# Altium schematic sheet Power.SchDoc
size A
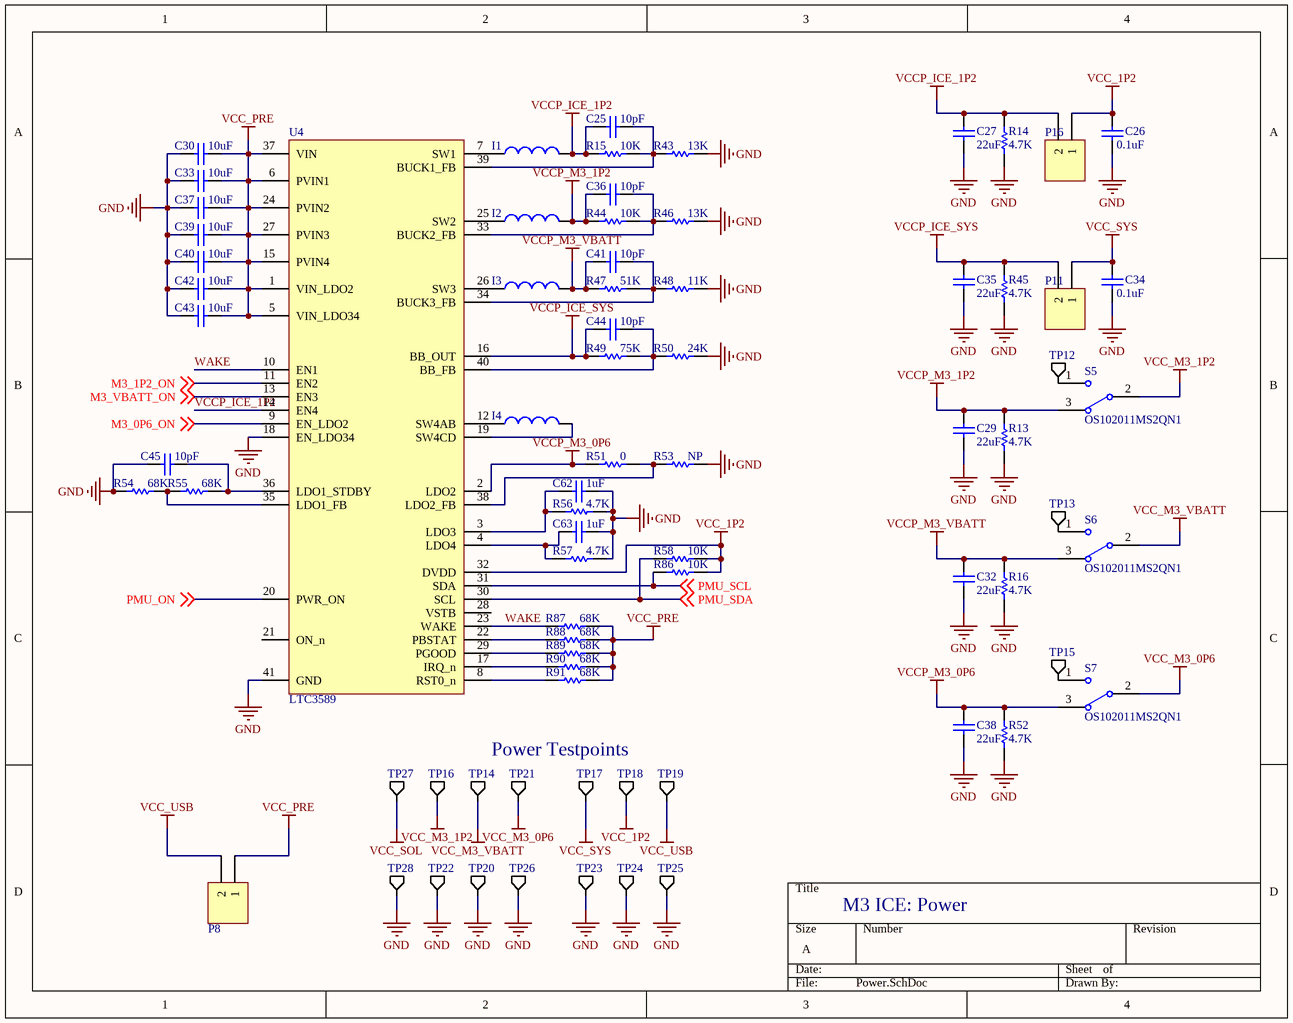
[diagram p0: Power.SchDoc]

## Parts
C25  value 10pF  [0402]  (hidden comment: Cap Semi)
C26  value 0.1uF  [1608[0603]]  (hidden comment: Cap Semi)
C27  value 22uF  [0805]  (hidden comment: Cap Chip)
C29  value 22uF  [0805]  (hidden comment: Cap Chip)
C30  value 10uF  [0805]  (hidden comment: Cap Chip)
C32  value 22uF  [0805]  (hidden comment: Cap Chip)
C33  value 10uF  [0805]  (hidden comment: Cap Chip)
C34  value 0.1uF  [1608[0603]]  (hidden comment: Cap Semi)
C35  value 22uF  [0805]  (hidden comment: Cap Chip)
C36  value 10pF  [0402]  (hidden comment: Cap Semi)
C37  value 10uF  [0805]  (hidden comment: Cap Chip)
C38  value 22uF  [0805]  (hidden comment: Cap Chip)
C39  value 10uF  [0805]  (hidden comment: Cap Chip)
C40  value 10uF  [0805]  (hidden comment: Cap Chip)
C41  value 10pF  [0402]  (hidden comment: Cap Semi)
C42  value 10uF  [0805]  (hidden comment: Cap Chip)
C43  value 10uF  [0805]  (hidden comment: Cap Chip)
C44  value 10pF  [0402]  (hidden comment: Cap Semi)
C45  value 10pF  [0402]  (hidden comment: Cap Semi)
C62  value 1uF  [0402]  (hidden comment: Cap Semi)
C63  value 1uF  [0402]  (hidden comment: Cap Semi)
I1  NR5040T1R5N  [INDUCTOR_.118x.142mm]  (value not drawn)
I2  NR5040T1R5N  [INDUCTOR_.118x.142mm]  (value not drawn)
I3  NR5040T1R5N  [INDUCTOR_.118x.142mm]  (value not drawn)
I4  NR5040T1R5N  [INDUCTOR_.118x.142mm]  (value not drawn)
P8  Header 2  [HDR1X2]  (value not drawn)
P11  Header 2  [HDR1X2]  (value not drawn)
P16  Header 2  [HDR1X2]  (value not drawn)
R13  value 4.7K  [0603]  (hidden comment: Res Chip)
R14  value 4.7K  [0603]  (hidden comment: Res Chip)
R15  value 10K  [0402]  (hidden comment: Res Chip)
R16  value 4.7K  [0603]  (hidden comment: Res Chip)
R43  value 13K  [0402]  (hidden comment: Res Chip)
R44  value 10K  [0402]  (hidden comment: Res Chip)
R45  value 4.7K  [0603]  (hidden comment: Res Chip)
R46  value 13K  [0402]  (hidden comment: Res Chip)
R47  value 51K  [0402]  (hidden comment: Res Chip)
R48  value 11K  [0402]  (hidden comment: Res Chip)
R49  value 75K  [0402]  (hidden comment: Res Chip)
R50  value 24K  [0402]  (hidden comment: Res Chip)
R51  value 0  [0402]  (hidden comment: Res Chip)
R52  value 4.7K  [0603]  (hidden comment: Res Chip)
R53  value NP  [0402]  (hidden comment: Res Chip)
R54  value 68K  [0402]  (hidden comment: Res Chip)
R55  value 68K  [0402]  (hidden comment: Res Chip)
R56  value 4.7K  [0402]  (hidden comment: Res Chip)
R57  value 4.7K  [0402]  (hidden comment: Res Chip)
R58  value 10K  [0402]  (hidden comment: Res Chip)
R86  value 10K  [0402]  (hidden comment: Res Chip)
R87  value 68K  [0402]  (hidden comment: Res Chip)
R88  value 68K  [0402]  (hidden comment: Res Chip)
R89  value 68K  [0402]  (hidden comment: Res Chip)
R90  value 68K  [0402]  (hidden comment: Res Chip)
R91  value 68K  [0402]  (hidden comment: Res Chip)
S5  OS102011MS2QN1  [SPDT_SW2]
S6  OS102011MS2QN1  [SPDT_SW2]
S7  OS102011MS2QN1  [SPDT_SW2]
TP12  TP  [TP]  (value not drawn)
TP13  TP  [TP]  (value not drawn)
TP14  TP  [TP]  (value not drawn)
TP15  TP  [TP]  (value not drawn)
TP16  TP  [TP]  (value not drawn)
TP17  TP  [TP]  (value not drawn)
TP18  TP  [TP]  (value not drawn)
TP19  TP  [TP]  (value not drawn)
TP20  TP  [TP]  (value not drawn)
TP21  TP  [TP]  (value not drawn)
TP22  TP  [TP]  (value not drawn)
TP23  TP  [TP]  (value not drawn)
TP24  TP  [TP]  (value not drawn)
TP25  TP  [TP]  (value not drawn)
TP26  TP  [TP]  (value not drawn)
TP27  TP  [TP]  (value not drawn)
TP28  TP  [TP]  (value not drawn)
U4  LTC3589  [QFN-40]

## Nets
GND: C26.1 C27.1 C29.1 C30.2 C32.1 C33.2 C34.1 C35.1 C37.2 C38.1 C39.2 C40.2 C42.2 C43.2 C45.2 C62.1 C63.1 R13.1 R14.1 R16.1 R43.2 R45.1 R46.2 R48.2 R50.2 R52.1 R53.2 R54.1 R56.2 R57.2 TP20.1(A) TP22.1(A) TP23.1(A) TP24.1(A) TP25.1(A) TP26.1(A) TP28.1(A) U4.18(EN_LDO34) U4.41(GND)
VCC_1P2: C26.2 P16.1 R58.2 R86.2 TP18.1(A) U4.32(DVDD)
VCC_M3_0P6: S7.2 TP21.1(A)
VCC_M3_1P2: S5.2 TP16.1(A)
VCC_M3_VBATT: S6.2 TP14.1(A)
VCC_PRE: C30.1 C33.1 C37.1 C39.1 C40.1 C42.1 C43.1 P8.1 R87.2 R88.2 R89.2 R90.2 R91.2 U4.1(VIN_LDO2) U4.5(VIN_LDO34) U4.6(PVIN1) U4.15(PVIN4) U4.24(PVIN2) U4.27(PVIN3) U4.37(VIN)
VCC_SOL: TP27.1(A)
VCC_SYS: C34.2 P11.1 TP17.1(A)
VCC_USB: P8.2 TP19.1(A)
VCCP_ICE_1P2: C25.2 C27.2 I1.2 P16.2 R14.2 R15.1 U4.14(EN4)
VCCP_ICE_SYS: C35.2 C44.2 P11.2 R45.2 R49.1 U4.16(BB_OUT)
VCCP_M3_0P6: C38.2 R51.1 R52.2 S7.3 U4.2(LDO2)
VCCP_M3_1P2: C29.2 C36.2 I2.2 R13.2 R44.1 S5.3
VCCP_M3_VBATT: C32.2 C41.2 I3.2 R16.2 R47.1 S6.3
M3_0P6_ON: U4.9(EN_LDO2) ; off-sheet M3_0P6_ON
M3_1P2_ON: U4.11(EN2) ; off-sheet M3_1P2_ON
M3_VBATT_ON: U4.13(EN3) ; off-sheet M3_VBATT_ON
PMU_ON: U4.20(PWR_ON) ; off-sheet PMU_ON
PMU_SCL: R86.1 U4.31(SDA) ; off-sheet PMU_SCL
PMU_SDA: R58.1 U4.30(SCL) ; off-sheet PMU_SDA
WAKE: R87.1 U4.10(EN1) U4.23(WAKE)
NetC25_1: C25.1 R15.2 R43.1 U4.39(BUCK1_FB)
NetC36_1: C36.1 R44.2 R46.1 U4.33(BUCK2_FB)
NetC41_1: C41.1 R47.2 R48.1 U4.34(BUCK3_FB)
NetC44_1: C44.1 R49.2 R50.1 U4.40(BB_FB)
NetC45_1: C45.1 R55.2 U4.36(LDO1_STDBY)
NetC62_2: C62.2 R56.1 U4.3(LDO3)
NetC63_2: C63.2 R57.1 U4.4(LDO4)
NetI1_1: I1.1 U4.7(SW1)
NetI2_1: I2.1 U4.25(SW2)
NetI3_1: I3.1 U4.26(SW3)
NetI4_1: I4.1 U4.12(SW4AB)
NetI4_2: I4.2 U4.19(SW4CD)
NetR51_2: R51.2 R53.1 U4.38(LDO2_FB)
NetR54_2: R54.2 R55.1 U4.35(LDO1_FB)
NetR88_1: R88.1 U4.22(PBSTAT)
NetR89_1: R89.1 U4.29(PGOOD)
NetR90_1: R90.1 U4.17(IRQ_n)
NetR91_1: R91.1 U4.8(RST0_n)
NetS5_1: S5.1 TP12.1(A)
NetS6_1: S6.1 TP13.1(A)
NetS7_1: S7.1 TP15.1(A)

Not connected (* = marked no-connect by the designer): U4 21(ON_n) 28(VSTB)

## Notes on the sheet
- Power Testpoints
- M3 ICE: Power

## Library data of the parts
C25 C36 C41 C44 C45 = Cap Semi: Capacitor (Semiconductor SIM Model); DistPartNo: 445-1235-1-ND; ManPartNo: C1005C0G1H100D; Published: 8-Jun-2000; LatestRevisionDate: 29-May-2009; LatestRevisionNote: IPC-7351 Footprint Added.; PackageReference: C1206; Publisher: Altium Limited; PackageDescription: Chip Capacitor
C26 C34 = Cap Semi: Capacitor (Semiconductor SIM Model); DistPartNo: 445-1317-1-ND; ManPartNo: C1608X7R1C104K; Published: 8-Jun-2000; LatestRevisionDate: 29-May-2009; LatestRevisionNote: IPC-7351 Footprint Added.; PackageReference: C1206; Publisher: Altium Limited; PackageDescription: Chip Capacitor
C27 C29 C32 C35 C38 = Cap Chip: Capacitor (Semiconductor SIM Model); DistPartNo: 587-2782-1-ND; ManPartNo: LMK316AB7226ML-TR; Published: 8-Jun-2000; LatestRevisionDate: 29-May-2009; LatestRevisionNote: IPC-7351 Footprint Added.; PackageReference: C1206; Publisher: Altium Limited; PackageDescription: Chip Capacitor
C30 C33 C37 C39 C40 C42 C43 = Cap Chip: Capacitor (Semiconductor SIM Model); DistPartNo: 445-6857-1-ND; ManPartNo: C2012X7R1A106K; Published: 8-Jun-2000; LatestRevisionDate: 29-May-2009; LatestRevisionNote: IPC-7351 Footprint Added.; PackageReference: C1206; Publisher: Altium Limited; PackageDescription: Chip Capacitor
C62 C63 = Cap Semi: Capacitor (Semiconductor SIM Model); DistPartNo: 445-4991-1-ND; ManPartNo: C1005X5R1A105M; Published: 8-Jun-2000; LatestRevisionDate: 29-May-2009; LatestRevisionNote: IPC-7351 Footprint Added.; PackageReference: C1206; Publisher: Altium Limited; PackageDescription: Chip Capacitor
I1-I4 = IHLP1212: DistPartNo: 541-1327-1-ND; ManPartNo: IHLP1212AEER1R0M11
P8 P11 P16 = Header 2: Header, 2-Pin; LatestRevisionDate: 17-Jul-2002; LatestRevisionNote: Re-released for DXP Platform.; Publisher: Altium Limited
R13 R14 R16 R45 R52 = Res Chip: Semiconductor Resistor; DistPartNo: P4.7KGCT-ND; ManPartNo: ERJ-3GEYJ472V; Published: 8-Jun-2000; LatestRevisionDate: 17-Jul-2002; LatestRevisionNote: Re-released for DXP Platform.; PackageReference: AXIAL-0.5; Publisher: Altium Limited; PackageDescription: Axial Device, Thru-Hole; 2 Leads; 0.5 in Pin Spacing
R15 R44 R58 R86 = Res Chip: Semiconductor Resistor; DistPartNo: P10.0KLCT-ND; ManPartNo: ERJ-2RKF1002X; Published: 8-Jun-2000; LatestRevisionDate: 17-Jul-2002; LatestRevisionNote: Re-released for DXP Platform.; PackageReference: AXIAL-0.5; Publisher: Altium Limited; PackageDescription: Axial Device, Thru-Hole; 2 Leads; 0.5 in Pin Spacing
R43 R46 = Res Chip: Semiconductor Resistor; DistPartNo: 311-13.0KLRCT-ND; ManPartNo: RC0402FR-0713KL; Published: 8-Jun-2000; LatestRevisionDate: 17-Jul-2002; LatestRevisionNote: Re-released for DXP Platform.; PackageReference: AXIAL-0.5; Publisher: Altium Limited; PackageDescription: Axial Device, Thru-Hole; 2 Leads; 0.5 in Pin Spacing
R47 = Res Chip: Semiconductor Resistor; DistPartNo: P51.0KLCT-ND; ManPartNo: ERJ-2RKF5102X; Published: 8-Jun-2000; LatestRevisionDate: 17-Jul-2002; LatestRevisionNote: Re-released for DXP Platform.; PackageReference: AXIAL-0.5; Publisher: Altium Limited; PackageDescription: Axial Device, Thru-Hole; 2 Leads; 0.5 in Pin Spacing
R48 = Res Chip: Semiconductor Resistor; DistPartNo: P11.0KLCT-ND; ManPartNo: ERJ-2RKF1102X; Published: 8-Jun-2000; LatestRevisionDate: 17-Jul-2002; LatestRevisionNote: Re-released for DXP Platform.; PackageReference: AXIAL-0.5; Publisher: Altium Limited; PackageDescription: Axial Device, Thru-Hole; 2 Leads; 0.5 in Pin Spacing
R49 = Res Chip: Semiconductor Resistor; DistPartNo: P75.0KLCT-ND; ManPartNo: ERJ-2RKF7502X; Published: 8-Jun-2000; LatestRevisionDate: 17-Jul-2002; LatestRevisionNote: Re-released for DXP Platform.; PackageReference: AXIAL-0.5; Publisher: Altium Limited; PackageDescription: Axial Device, Thru-Hole; 2 Leads; 0.5 in Pin Spacing
R50 = Res Chip: Semiconductor Resistor; DistPartNo: RMCF0402FT24K0CT-ND; ManPartNo: RMCF0402FT24K0; Published: 8-Jun-2000; LatestRevisionDate: 17-Jul-2002; LatestRevisionNote: Re-released for DXP Platform.; PackageReference: AXIAL-0.5; Publisher: Altium Limited; PackageDescription: Axial Device, Thru-Hole; 2 Leads; 0.5 in Pin Spacing
R51 = Res Chip: Semiconductor Resistor; DistPartNo: P0.0JCT-ND; ManPartNo: ERJ-2GE0R00X; Published: 8-Jun-2000; LatestRevisionDate: 17-Jul-2002; LatestRevisionNote: Re-released for DXP Platform.; PackageReference: AXIAL-0.5; Publisher: Altium Limited; PackageDescription: Axial Device, Thru-Hole; 2 Leads; 0.5 in Pin Spacing
R53 = Res Chip: Semiconductor Resistor; Published: 8-Jun-2000; LatestRevisionDate: 17-Jul-2002; LatestRevisionNote: Re-released for DXP Platform.; PackageReference: AXIAL-0.5; Publisher: Altium Limited; PackageDescription: Axial Device, Thru-Hole; 2 Leads; 0.5 in Pin Spacing
R54 R55 R87-R91 = Res Chip: Semiconductor Resistor; DistPartNo: P68.0KLCT-ND; ManPartNo: ERJ-2RKF6802X; Published: 8-Jun-2000; LatestRevisionDate: 17-Jul-2002; LatestRevisionNote: Re-released for DXP Platform.; PackageReference: AXIAL-0.5; Publisher: Altium Limited; PackageDescription: Axial Device, Thru-Hole; 2 Leads; 0.5 in Pin Spacing
R56 R57 = Res Chip: Semiconductor Resistor; DistPartNo: P4.70KLCT-ND; ManPartNo: ERJ-2RKF4701X; Published: 8-Jun-2000; LatestRevisionDate: 17-Jul-2002; LatestRevisionNote: Re-released for DXP Platform.; PackageReference: AXIAL-0.5; Publisher: Altium Limited; PackageDescription: Axial Device, Thru-Hole; 2 Leads; 0.5 in Pin Spacing
S5-S7 = OS102011MS2QN1: SPDT Slide Switch; DistPartNo: CKN9565-ND; ManPartNo: OS102011MS2QN1
U4 = LTC3589: DistPartNo: LTC3589EUJ-2#PBF-ND; ManPartNo: LTC3589EUJ-2#PBF